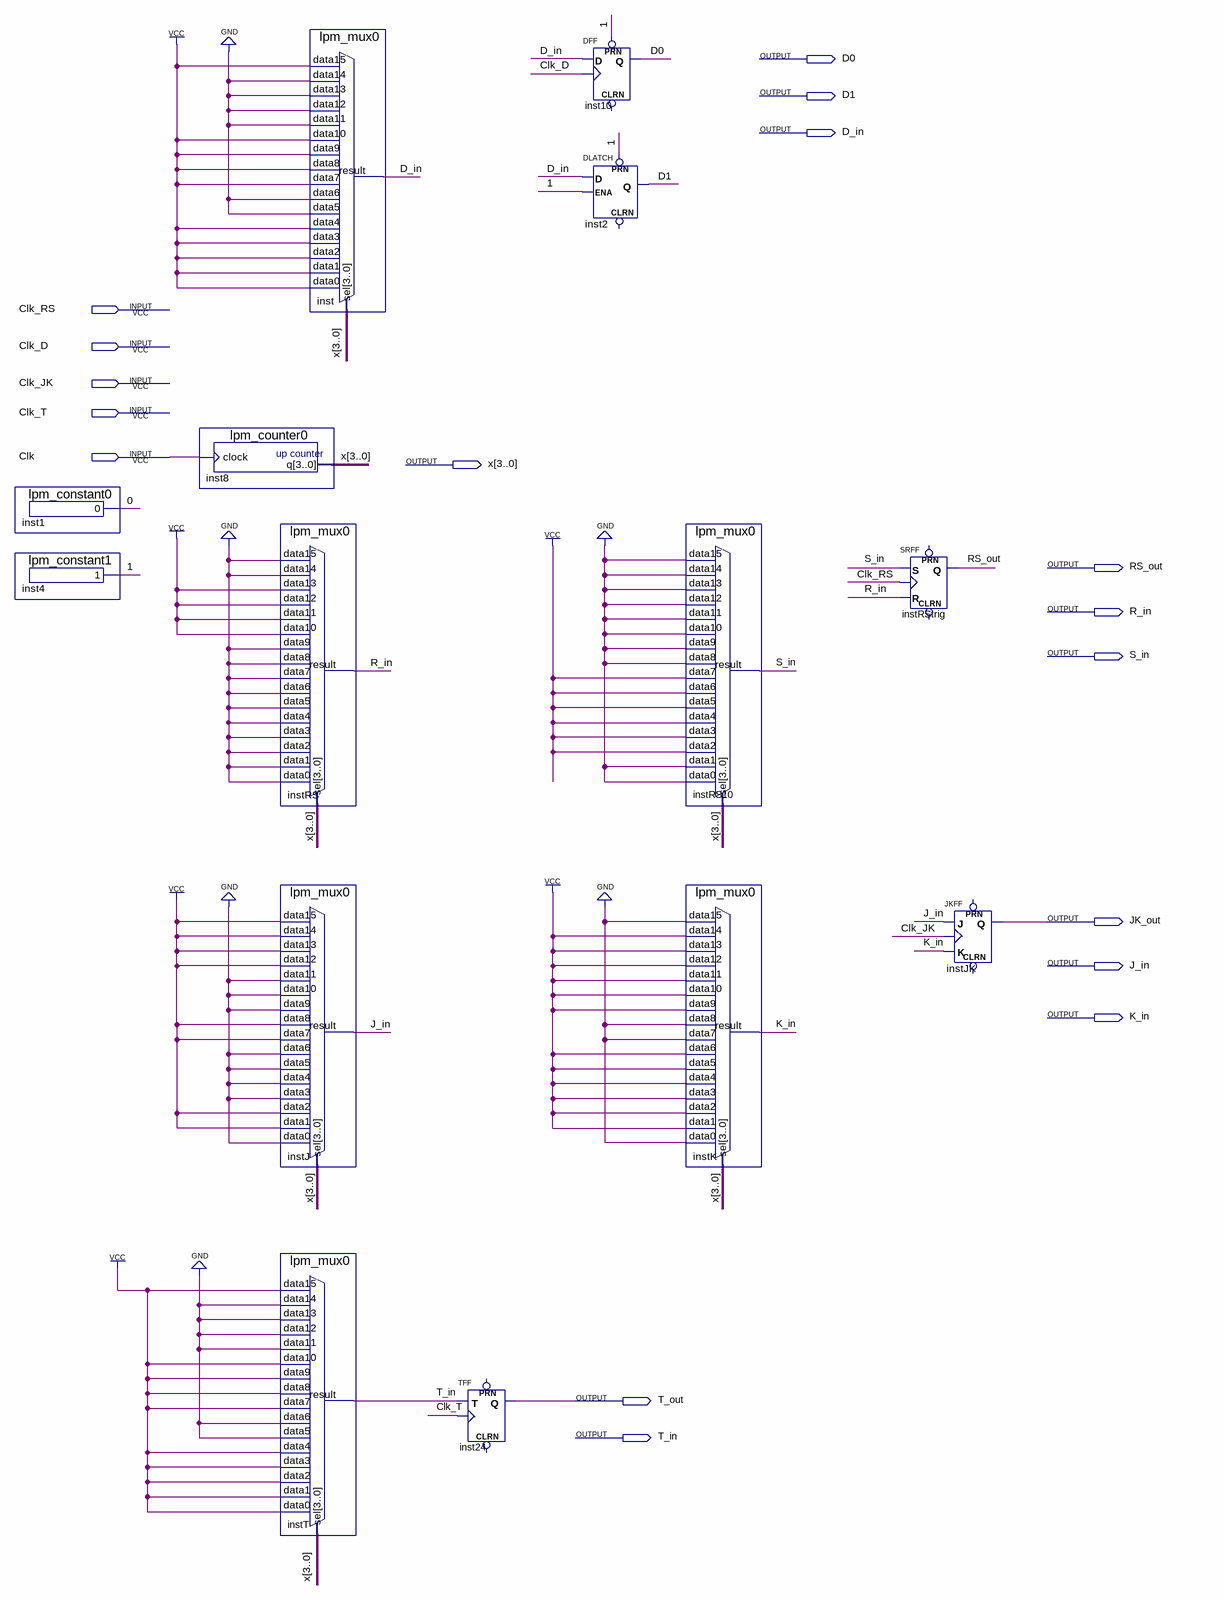
[diagram p0: schematic sheet]
// Quartus schematic lab4.bdf as structural Verilog: 14 symbols, 17 pins
module lab4 (
  input  Clk_RS,
  input  Clk_D,
  input  Clk_JK,
  input  Clk_T,
  input  Clk,
  output D0,
  output D1,
  output D_in,
  output [3:0] x,
  output RS_out,
  output R_in,
  output S_in,
  output JK_out,
  output J_in,
  output K_in,
  output T_out,
  output T_in
);

  wire \0 , \1 ;

  lpm_constant0 inst1 (.result(\0 ));
  lpm_constant1 inst4 (.result(\1 ));
  lpm_counter0 inst8 (.clock(Clk), .q(x));
  lpm_mux0 instRS (
    .data15(1'b0), .data14(1'b0), .data13(1'b1), .data12(1'b1), .data11(1'b1), .data10(1'b1), .data9(1'b0),
    .data8(1'b0), .data7(1'b0), .data6(1'b0), .data5(1'b0), .data4(1'b0), .data3(1'b0), .data2(1'b0),
    .data1(1'b0), .data0(1'b0), .sel(x), .result(R_in));
  lpm_mux0 instJ (
    .data15(1'b1), .data14(1'b1), .data13(1'b1), .data12(1'b1), .data11(1'b0), .data10(1'b0), .data9(1'b0),
    .data8(1'b1), .data7(1'b1), .data6(1'b0), .data5(1'b0), .data4(1'b0), .data3(1'b0), .data2(1'b1),
    .data1(1'b1), .data0(1'b0), .sel(x), .result(J_in));
  lpm_mux0 instT (
    .data15(1'b1), .data14(1'b0), .data13(1'b0), .data12(1'b0), .data11(1'b0), .data10(1'b1), .data9(1'b1),
    .data8(1'b1), .data7(1'b1), .data6(1'b0), .data5(1'b0), .data4(1'b1), .data3(1'b1), .data2(1'b1),
    .data1(1'b1), .data0(1'b1), .sel(x), .result(T_in));
  lpm_mux0 inst (
    .data15(1'b1), .data14(1'b0), .data13(1'b0), .data12(1'b0), .data11(1'b0), .data10(1'b1), .data9(1'b1),
    .data8(1'b1), .data7(1'b1), .data6(1'b0), .data5(1'b0), .data4(1'b1), .data3(1'b1), .data2(1'b1),
    .data1(1'b1), .data0(1'b1), .sel(x), .result(D_in));
  TFF inst24 (.T(T_in), .CLK(Clk_T), .Q(T_out));  // open: PRN, CLRN
  DFF inst10 (.CLK(Clk_D), .D(D_in), .PRN(\1 ), .Q(D0));  // open: CLRN
  DLATCH inst2 (.D(D_in), .ENA(\1 ), .PRN(\1 ), .Q(D1));  // open: CLRN
  lpm_mux0 instRS10 (
    .data15(1'b0), .data14(1'b0), .data13(1'b0), .data12(1'b0), .data11(1'b0), .data10(1'b0), .data9(1'b0),
    .data8(1'b0), .data7(1'b1), .data6(1'b1), .data5(1'b1), .data4(1'b1), .data3(1'b1), .data2(1'b1),
    .data1(1'b0), .data0(1'b0), .sel(x), .result(S_in));
  lpm_mux0 instK (
    .data15(1'b0), .data14(1'b1), .data13(1'b1), .data12(1'b1), .data11(1'b1), .data10(1'b1), .data9(1'b1),
    .data8(1'b0), .data7(1'b0), .data6(1'b1), .data5(1'b1), .data4(1'b1), .data3(1'b1), .data2(1'b1),
    .data1(1'b1), .data0(1'b0), .sel(x), .result(K_in));
  SRFF instRStrig (.S(S_in), .R(R_in), .CLK(Clk_RS), .Q(RS_out));  // open: PRN, CLRN
  JKFF instJK (.K(K_in), .J(J_in), .CLK(Clk_JK), .Q(JK_out));  // open: PRN, CLRN
endmodule
